# EAGLE schematic rgbamp (EAGLE 6.1)
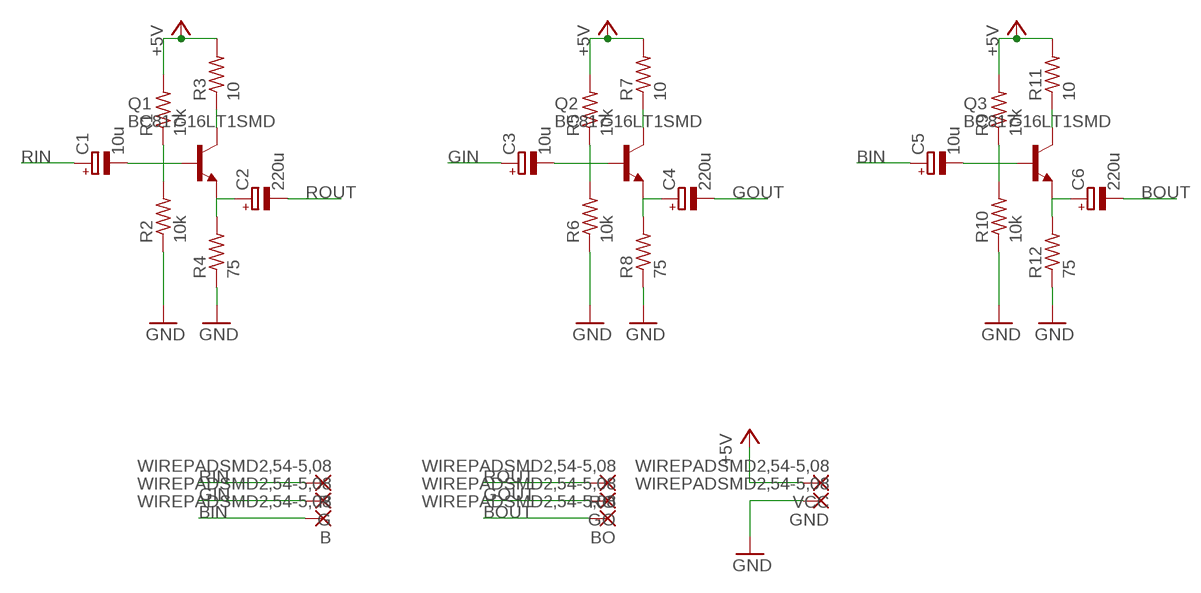
[diagram p0: schematic, sheet 1]

## Parts
B  WIREPADSMD2,54-5,08  [SMD2,54-5,08]
BO  WIREPADSMD2,54-5,08  [SMD2,54-5,08]
C1  10u  CPOL-EU150CLZ-0810  [150CLZ-0810]
C2  220u  CPOL-EU150CLZ-0810  [150CLZ-0810]
C3  10u  CPOL-EU150CLZ-0810  [150CLZ-0810]
C4  220u  CPOL-EUD  [PANASONIC_D]
C5  10u  CPOL-EU150CLZ-0810  [150CLZ-0810]
C6  220u  CPOL-EUD  [PANASONIC_D]
G  WIREPADSMD2,54-5,08  [SMD2,54-5,08]
GND  WIREPADSMD2,54-5,08  [SMD2,54-5,08]
GO  WIREPADSMD2,54-5,08  [SMD2,54-5,08]
Q1  BC817-16LT1SMD  [SOT23-BEC]
Q2  BC817-16LT1SMD  [SOT23-BEC]
Q3  BC817-16LT1SMD  [SOT23-BEC]
R  WIREPADSMD2,54-5,08  [SMD2,54-5,08]
R1  10k  R-US_M1206  [M1206]
R2  10k  R-US_M1206  [M1206]
R3  10  R-US_M1206  [M1206]
R4  75  R-US_M1206  [M1206]
R5  10k  R-US_M1206  [M1206]
R6  10k  R-US_M1206  [M1206]
R7  10  R-US_M1206  [M1206]
R8  75  R-US_M1206  [M1206]
R9  10k  R-US_M1206  [M1206]
R10  10k  R-US_M1206  [M1206]
R11  10  R-US_M1206  [M1206]
R12  75  R-US_M1206  [M1206]
RO  WIREPADSMD2,54-5,08  [SMD2,54-5,08]
VCC  WIREPADSMD2,54-5,08  [SMD2,54-5,08]

## Nets
+5V: R1.2 R3.2 R5.2 R7.2 R9.2 R11.2 VCC.1(P)
BIN: B.1(P) C5.+
BOUT: BO.1(P) C6.-
GIN: C3.+ G.1(P)
GND: GND.1(P) R2.1 R4.1 R6.1 R8.1 R10.1 R12.1
GOUT: C4.- GO.1(P)
N$1: C1.- Q1.B R1.1 R2.2
N$2: C2.+ Q1.E R4.2
N$3: C3.- Q2.B R5.1 R6.2
N$4: Q1.C R3.1
N$5: Q2.C R7.1
N$6: C4.+ Q2.E R8.2
N$7: C5.- Q3.B R9.1 R10.2
N$8: Q3.C R11.1
N$9: C6.+ Q3.E R12.2
RIN: C1.+ R.1(P)
ROUT: C2.- RO.1(P)

## Library data of the parts
B BO G GND GO R RO VCC = wirepad:WIREPAD: Wire PAD connect wire on PCB
C1-C6 = resistor:CPOL-EU: POLARIZED CAPACITOR, European symbol
Q1-Q3 = transistor-npn:BC817*: NPN Transistor
R1-R12 = resistor:R-US_: RESISTOR, American symbol